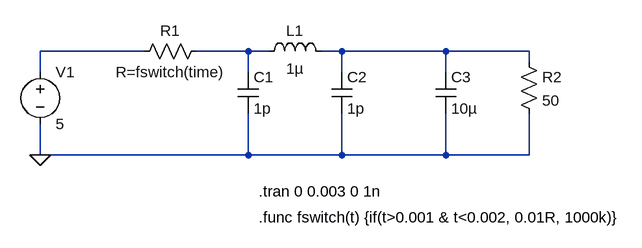
[diagram p0: schematic Contactarcing_test1.asc]
Contactarcing_test1.asc, the LTspice schematic file:
Version 4
SHEET 1 992 680
WIRE 176 64 16 64
WIRE 336 64 256 64
WIRE 368 64 336 64
WIRE 480 64 448 64
WIRE 640 64 480 64
WIRE 768 64 640 64
WIRE 768 80 768 64
WIRE 16 96 16 64
WIRE 336 96 336 64
WIRE 480 96 480 64
WIRE 640 96 640 64
WIRE 16 224 16 176
WIRE 336 224 336 160
WIRE 336 224 16 224
WIRE 480 224 480 160
WIRE 480 224 336 224
WIRE 640 224 640 160
WIRE 640 224 480 224
WIRE 768 224 768 160
WIRE 768 224 640 224
FLAG 16 224 0
SYMBOL voltage 16 80 R0
WINDOW 123 0 0 Left 0
WINDOW 39 0 0 Left 0
SYMATTR InstName V1
SYMATTR Value 5
SYMBOL res 272 48 R90
WINDOW 0 0 56 VBottom 2
WINDOW 3 32 56 VTop 2
SYMATTR InstName R1
SYMATTR Value R=fswitch(time)
SYMBOL res 752 64 R0
SYMATTR InstName R2
SYMATTR Value 50
SYMBOL cap 320 96 R0
SYMATTR InstName C1
SYMATTR Value 1p
SYMBOL cap 464 96 R0
SYMATTR InstName C2
SYMATTR Value 1p
SYMBOL cap 624 96 R0
SYMATTR InstName C3
SYMATTR Value 10µ
SYMBOL ind 464 80 M270
WINDOW 0 32 56 VTop 2
WINDOW 3 5 56 VBottom 2
SYMATTR InstName L1
SYMATTR Value 1µ
TEXT 352 280 Left 2 !.tran 0 0.003 0 1n
TEXT 352 320 Left 2 !.func fswitch(t) {if(t>0.001 & t<0.002, 0.01R, 1000k)}

The netlist it stands for:
* Contactarcing_test1.asc
V1 N001 0 5
R1 N002 N001 R=fswitch(time)
R2 N003 0 50
C1 N002 0 1p
C2 N003 0 1p
C3 N003 0 10µ
L1 N003 N002 1µ
.tran 0 0.003 0 1n
.func fswitch(t) {if(t>0.001 & t<0.002, 0.01R, 1000k)}
.backanno
.end